# Altium schematic sheet AFE.OG.SchDoc
size A
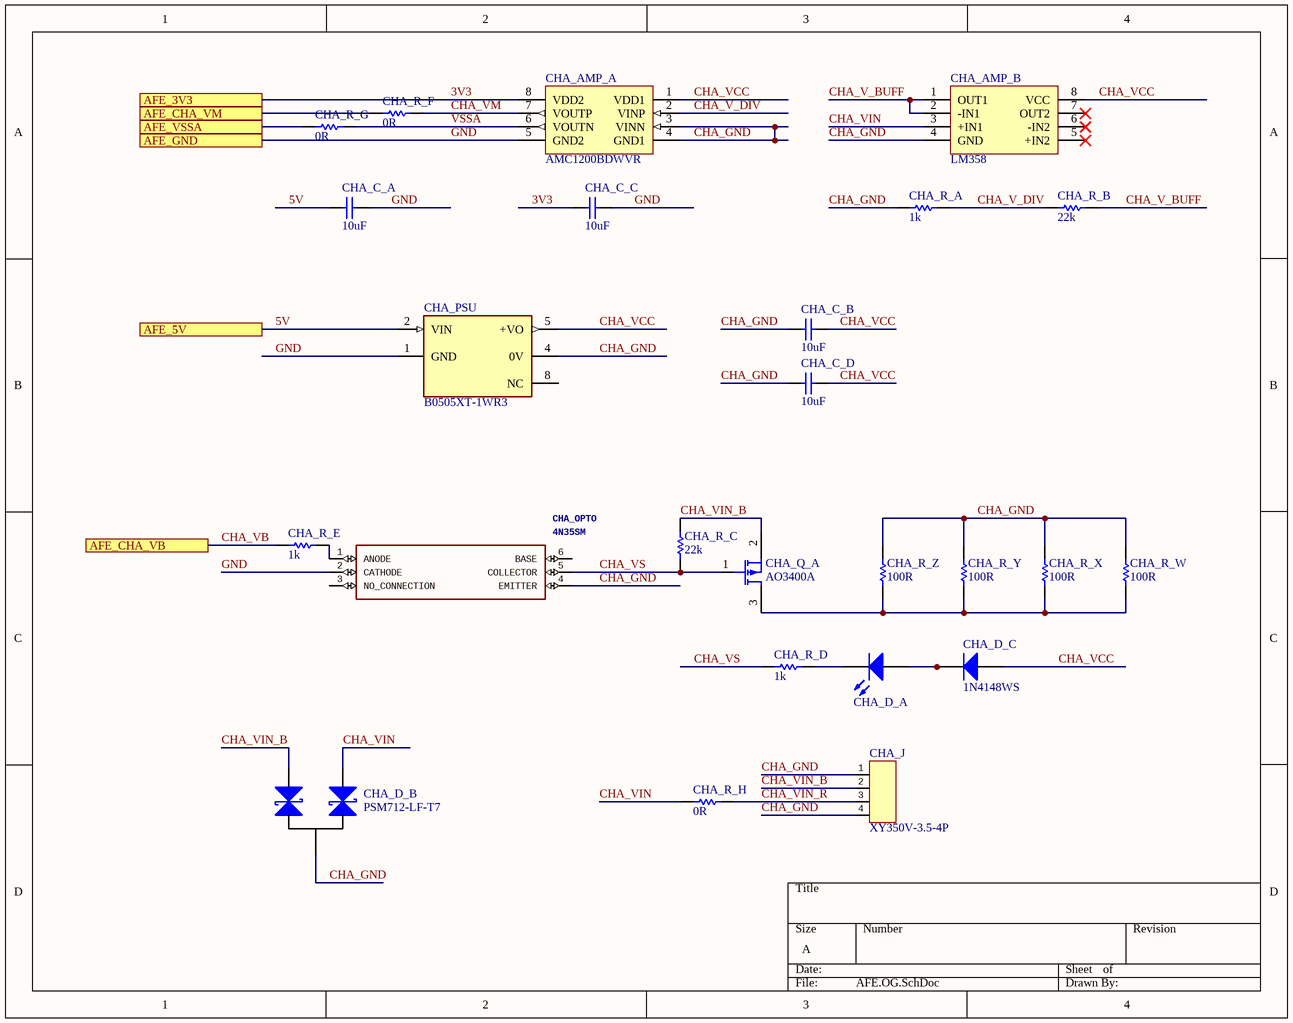
[diagram p0: AFE.OG.SchDoc]

## Parts
CHA_AMP_A  AMC1200BDWVR  [SOIC-8-P1.27-W7.5]
CHA_AMP_B  LM358  [SOIC-8-P1.27-W3.5]
CHA_C_A  value 10uF  [C_0603]  (hidden comment: CL10A106MA8NRNC)
CHA_C_B  value 10uF  [C_0603]  (hidden comment: CL10A106MA8NRNC)
CHA_C_C  value 10uF  [C_0603]  (hidden comment: CL10A106MA8NRNC)
CHA_C_D  value 10uF  [C_0603]  (hidden comment: CL10A106MA8NRNC)
CHA_D_A  KT-0603R  [D_0603]  (value not drawn)
CHA_D_B  PSM712-LF-T7  [TO-236AB]
CHA_D_C  1N4148WS  [SOD-323]
CHA_J  XY350V-3.5-4P  [XY350V-3.5-4P]
CHA_OPTO  4N35SM  [SOT254P916X508-6N]
CHA_PSU  B0505XT-1WR3  [CONV_B0512XT-1WR3]
CHA_Q_A  AO3400A  [TO-236AB]
CHA_R_A  value 1k  [R_0603]  (hidden comment: 0603WAF1001T5E)
CHA_R_B  value 22k  [R_0603]  (hidden comment: 0603WAF2202T5E)
CHA_R_C  value 22k  [R_0603]  (hidden comment: 0603WAF2202T5E)
CHA_R_D  value 1k  [R_0603]  (hidden comment: 0603WAF1001T5E)
CHA_R_E  value 1k  [R_0603]  (hidden comment: 0603WAF1001T5E)
CHA_R_F  value 0R  [R_0603]  (hidden comment: 0603WAF0000T5E)
CHA_R_G  value 0R  [R_0603]  (hidden comment: 0603WAF0000T5E)
CHA_R_H  value 0R  [R_0603]  (hidden comment: 0603WAF0000T5E)
CHA_R_W  value 100R  [R_1206]  (hidden comment: 1206W4F1000T5E)
CHA_R_X  value 100R  [R_1206]  (hidden comment: 1206W4F1000T5E)
CHA_R_Y  value 100R  [R_1206]  (hidden comment: 1206W4F1000T5E)
CHA_R_Z  value 100R  [R_1206]  (hidden comment: 1206W4F1000T5E)

## Ports
AFE_3V3, AFE_5V, AFE_CHA_VB, AFE_CHA_VM, AFE_GND, AFE_VSSA

## Nets
3V3: CHA_AMP_A.8(VDD2) CHA_C_C.2 ; port AFE_3V3
5V: CHA_C_A.2 CHA_PSU.2(VIN) ; port AFE_5V
AFE_CHA_VM: CHA_R_F.1 ; port AFE_CHA_VM
AFE_VSSA: CHA_R_G.1 ; port AFE_VSSA
CHA_GND: CHA_AMP_A.3(VINN) CHA_AMP_A.4(GND1) CHA_AMP_B.4(GND) CHA_C_B.2 CHA_C_D.2 CHA_D_B.3(A) CHA_J.1 CHA_J.4 CHA_OPTO.4(EMITTER) CHA_PSU.4(0V) CHA_R_A.1 CHA_R_W.1 CHA_R_X.1 CHA_R_Y.1 CHA_R_Z.1
CHA_V_BUFF: CHA_AMP_B.1(OUT1) CHA_AMP_B.2(-IN1) CHA_R_B.2
CHA_V_DIV: CHA_AMP_A.2(VINP) CHA_R_A.2 CHA_R_B.1
CHA_VB: CHA_R_E.1 ; port AFE_CHA_VB
CHA_VCC: CHA_AMP_A.1(VDD1) CHA_AMP_B.8(VCC) CHA_C_B.1 CHA_C_D.1 CHA_D_C.2(A) CHA_PSU.5(+VO)
CHA_VIN: CHA_AMP_B.3(+IN1) CHA_D_B.2(K) CHA_R_H.1
CHA_VIN_B: CHA_D_B.1(K) CHA_J.2 CHA_Q_A.2(S) CHA_R_C.2
CHA_VIN_R: CHA_J.3 CHA_R_H.2
CHA_VM: CHA_AMP_A.7(VOUTP) CHA_R_F.2
CHA_VS: CHA_OPTO.5(COLLECTOR) CHA_Q_A.1(G) CHA_R_C.1 CHA_R_D.1
GND: CHA_AMP_A.5(GND2) CHA_C_A.1 CHA_C_C.1 CHA_OPTO.2(CATHODE) CHA_PSU.1(GND) ; port AFE_GND
VSSA: CHA_AMP_A.6(VOUTN) CHA_R_G.2
NetCHA_D_A_1: CHA_D_A.1(K) CHA_R_D.2
NetCHA_D_A_2: CHA_D_A.2(A) CHA_D_C.1(K)
NetCHA_OPTO_1: CHA_OPTO.1(ANODE) CHA_R_E.2
NetCHA_Q_A_3: CHA_Q_A.3(D) CHA_R_W.2 CHA_R_X.2 CHA_R_Y.2 CHA_R_Z.2

Not connected (* = marked no-connect by the designer): CHA_AMP_B 5(+IN2)* 6(-IN2)* 7(OUT2)*; CHA_OPTO 3(NO_CONNECTION) 6(BASE); CHA_PSU 8(NC)

## Library data of the parts
CHA_AMP_A = AMC1200BDWVR: U - IC - 100KHz ISOLATION AMPLIFIER; Speed: 100KHz; LCSC Part #: C79905; JLC Availability: Extended
CHA_AMP_B = LMV358IDR: U - IC - OP AMP (DUAL); Speed: 0.4V/us; LCSC Part #: C63813; JLC Availability: Extended
CHA_C_A CHA_C_B CHA_C_C CHA_C_D = CL10A106MA8NRNC: C - CAPACITOR - MLCC - 10uF - 25V - 0603; WVDC: 25; LCSC Part #: C96446; Availability: Basic
CHA_D_A = KT-0603R: D - LED - 0603 - Red; LCSC Part #: C2286; JLC Availability: Basic
CHA_D_B = PSM712-LF-T7: D - DIODE - TVS x2 - 7.2V; Vrrm: 7; If: 1A; LCSC Part #: C32677; JLC Availability: Basic
CHA_D_C = 1N4148WS: D - DIODE - FAST TRR - 100V - 150mA - 4ns; LCSC Part #: C2128; JLC Availability: Basic; PIV: 100V; If: 150mA; Trr: 4ns
CHA_J = XY350V-3.5-4P: J - JACK - TERMINAL - 4P - RIGHT - MALE; LCSC Part #: C557656; JLC Availability: Extended
CHA_OPTO = 4N35SM: Q - OPTOCOUPLER - 4170 V - 100% CTR; Manufacturer_Name: onsemi; GateName_1: G$1; SymbolName_1: 4N35SM; LibraryName: 4N35SM; DeviceSetName: 4N35SM; Package: SOT254P916X508-6N; LCSC Part #: C258228; Mouser_Price-Stock: https://www.mouser.co.uk/ProductDetail/onsemi-Fairchild/4N35SM?qs=VZOZQ19d7%2FIRbTYJunTCyQ%3D%3D; Manufacturer_Part_Number: 4N35SM; Height: 5.08mm
CHA_PSU = B0505XT-1WR3: T - Isolated Module DC DC Converter 5 -> 5V 200mA - DIP; MF: EVISUN; LCSC Part #: C19188495; Value: *; MP: B0505XT-1WR3; SnapEDA_Link: https://www.snapeda.com/parts/B0512XT-1WR3/MORNSUN/view-part/?ref=snap; Check_prices: https://www.snapeda.com/parts/B0512XT-1WR3/MORNSUN/view-part/?ref=eda
CHA_Q_A = AO3400A: Q - TRANSISTOR - MOSFET (P) - 20V - 3.4A - 0.26 Ohm; WVDC: 20; JLC Availability: Basic; LCSC Part #: C20917
CHA_R_A CHA_R_D CHA_R_E = 0603WAF1001T5E: R - RESISTOR - SMD - 1k - 1% - 0603; LCSC Part #: C21190; JLC Availability: Basic
CHA_R_B CHA_R_C = 0603WAF2202T5E: R - RESISTOR - SMD - 22k - 1% - 0603; LCSC Part #: C31850; JLC Availability: Basic
CHA_R_F CHA_R_G CHA_R_H = 0603WAF0000T5E: R - RESISTOR - SMD - 0R - 1% - 0603; LCSC Part #: C21189; JLC Availability: Basic
CHA_R_W CHA_R_X CHA_R_Y CHA_R_Z = 1206W4F1000T5E: R - RESISTOR - SMD - 100R - 1% - 1206; LCSC Part #: C17901; JLC Availability: Basic